# Altium schematic sheet InfraRed.SchDoc: Top Level
size A3; CompanyName: NOT USED; DocumentNumber: 2; SheetNumber: 2; SheetTotal: 10; PageSetup: Record=PageOptions|CenterHorizontal=True|CenterVertical=True|PrintScale=1.00|XCorrection=1.00|YCorrection=1.00|PrintKind=0|BorderSize=5000000|LeftOffset=0|BottomOffset=0|Orientation=2|PaperLength=1000|PaperWidth=1000|Scale=100|PaperSource=7|PrintQuality=-4|MediaType=1|DitherType=10|PaperKind=A3|PrintScaleMode=0
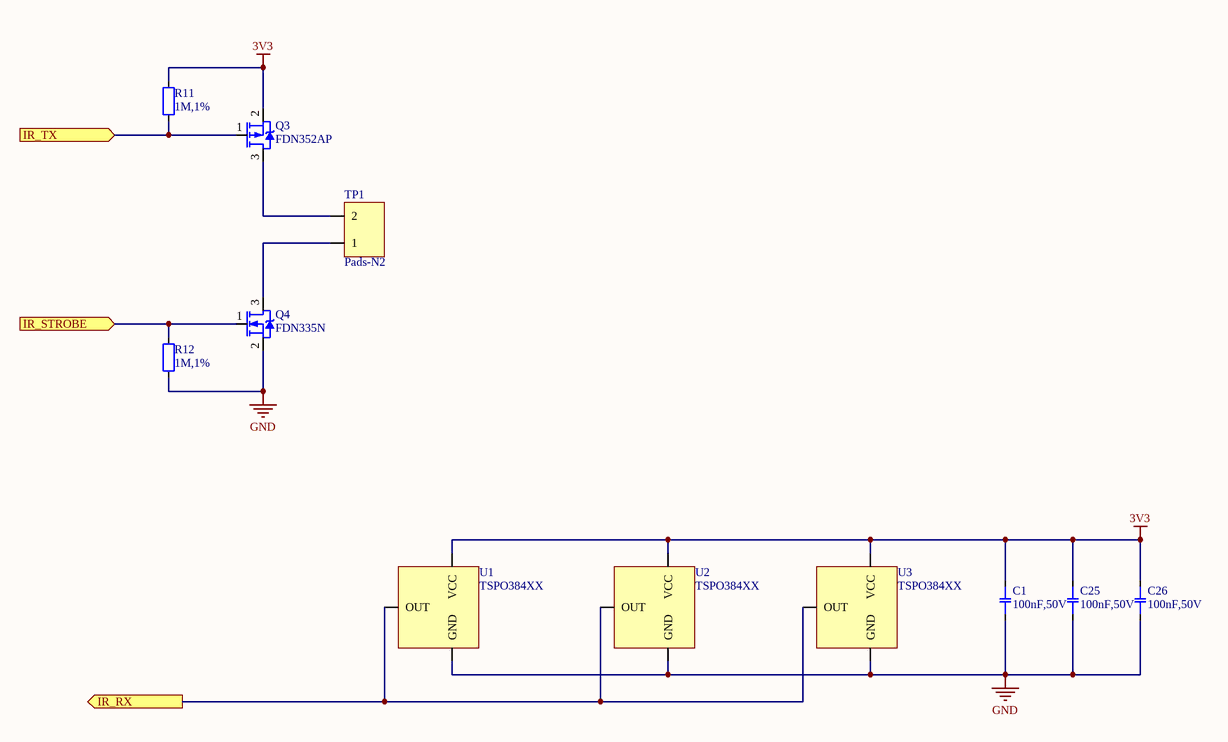
[diagram p0: InfraRed.SchDoc]

## Parts
C1  100nF,50V  [CAPC1608X09N_0603]
C25  100nF,50V  [CAPC1608X09N_0603]
C26  100nF,50V  [CAPC1608X09N_0603]
Q3  FDN352AP  [SOT95P230X110-3N_SOT23]
Q4  FDN335N  [SOT95P230X110-3N_SOT23]
R11  1M,1%  [RESC1608X06N_0603]
R12  1M,1%  [RESC1608X06N_0603]
TP1  Pads-N2  [PADS-N2]
U1  TSPO384XX  [VISHAY_TSOP_]
U2  TSPO384XX  [VISHAY_TSOP_]
U3  TSPO384XX  [VISHAY_TSOP_]

## Ports
IR_RX (out), IR_STROBE (in), IR_TX (in)

## Nets
3V3: C1.1 C25.1 C26.1 Q3.2(S) R11.1 U1.3(VCC) U2.3(VCC) U3.3(VCC)
GND: C1.2 C25.2 C26.2 Q4.2(S) R12.2 U1.2(GND) U2.2(GND) U3.2(GND)
IR_RX: U1.1(OUT) U2.1(OUT) U3.1(OUT) ; port IR_RX
IR_STROBE: Q4.1(G) R12.1 ; port IR_STROBE
IR_TX: Q3.1(G) R11.2 ; port IR_TX
NetQ3_3: Q3.3(D) TP1.2
NetQ4_3: Q4.3(D) TP1.1

## Notes on the sheet
- Project
- Size:
- Date:
- A3
- Revision:
- Sheet
- of
- Lambo
- File:

## Library data of the parts
C1 C25 C26 = CCH-104CH-G: CAP CER 0.1UF 50V 10% X7R 0603; Manufacturer: Kemet; Manufacturer Part Number: C0603C104K5RACTU; Type: Ceramic; Display_Name: 100nF,50V; Capacitance: 100nF; Dielectric: X7R; Tolerance: 10%; Voltage: 50V; BWA PN: CCH-104CH-G; Schematic Symbol: CAP-NP_1; Supplier 1: Digi-Key; Supplier Part Number 1: 399-5089-1-ND
Q3 = TRN-10006-A: MOSFET P-CH 30V 1.3A SSOT-3; Manufacturer: Fairchild; Type: P; Id(max): -1.3A; rds(on): 180mOhms; Vds(max): -30V; Vgs(max): +/-25V; Vth(max): -2.5V; Display_Name: FDN352AP; BWA PN: TRN-10006-A; Schematic Symbol: MOSFET-P_1; Manufacturer Part Number: FDN352AP; Supplier 1: Digi-Key; Supplier Part Number 1: FDN352APCT-ND
Q4 = TRN-10045-A: MOSFET N-CH 20V 1.7A SSOT3; Manufacturer: Fairchild Semiconductor; Type: N; rds(on): 70mOhm; Vgs(max): +/-8V; Vth(max): 1.5V; Display_Name: FDN335N; BWA PN: TRN-10045-A; Id(max): 1.7A; Vds(max): 20V; Schematic Symbol: MOSFET-N_1; Manufacturer Part Number: FDN335N; Supplier 1: Digi-Key; Supplier Part Number 1: FDN335NCT-ND
R11 R12 = RSH-1M000-D: RES 1.00M OHM 1/10W 1% 0603 SMD; Manufacturer: Yageo; Manufacturer Part Number: RC0603FR-071ML; Power: 0.1W; Display_Name: 1M,1%; Resistance: 1M; Tolerance: 1%; Type: Chip; BWA PN: RSH-1M000-D; Schematic Symbol: RESISTOR_1; Supplier 1: Digi-Key; Supplier Part Number 1: 311-1.00MHRCT-ND